# EAGLE design Nido (EAGLE 9.5.2)
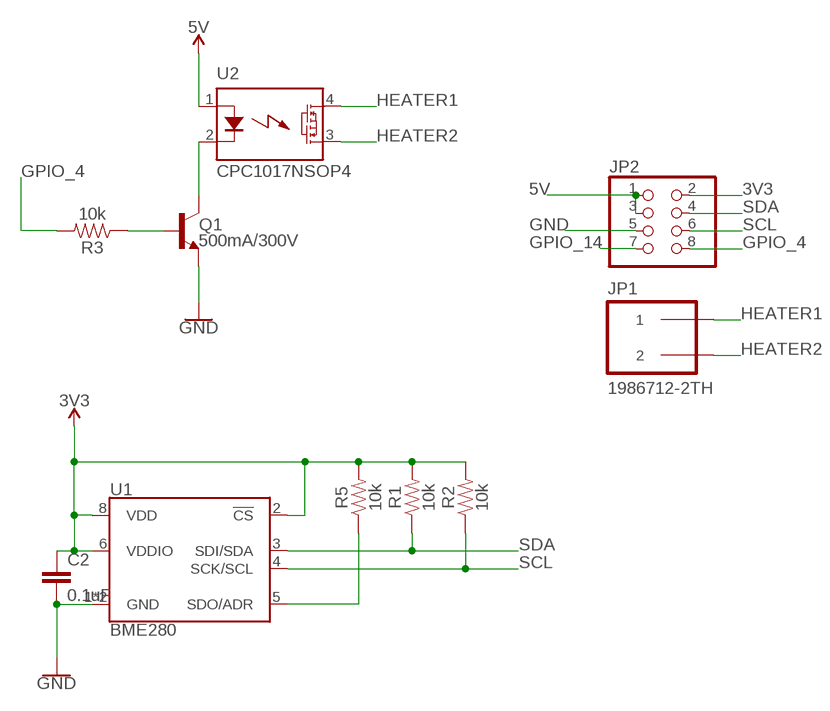
[diagram p0: schematic, sheet 1]

## Parts
C2  0.1uF  0.1UF-0402-16V-10%  [0402]
JP1  1986712-2TH  [1986712-2]
JP2  PINHD-2X4  [2X04]
Q1  500mA/300V  TRANS_NPN-MMBTA42  [SOT23-3]
R1  10k  10KOHM-0402-1/16W-1%  [0402]
R2  10k  10KOHM-0402-1/16W-1%  [0402]
R3  10k  10KOHM-0402-1/16W-1%  [0402]
R5  10k  10KOHM-0402-1/16W-1%  [0402]
U1  BME280  [LGA-8-2.5X2.5]
U2  CPC1017NSOP4  [CPC1017N]

## Nets
3V3: C2.1 JP2.2 R1.2 R2.2 R5.2 U1.2(!CS) U1.6(VDDIO) U1.8(VDD)
5V: JP2.1 JP2.3 U2.1(+CONTROL)
GND: C2.2 JP2.5 Q1.2(E) U1.1(GND) U1.7(GND)
GPIO_4: JP2.8 R3.2
GPIO_14: JP2.7
HEATER1: JP1.P$1 JP1.P$2 U2.4(LOAD2)
HEATER2: JP1.P$3 JP1.P$4 U2.3(LOAD1)
N$1: R5.1 U1.5(SDO/ADR)
N$5: Q1.3(C) U2.2(-CONTROL)
N$6: Q1.1(B) R3.1
SCL: JP2.6 R2.1 U1.4(SCK/SCL)
SDA: JP2.4 R1.1 U1.3(SDI/SDA)

## Library data of the parts
C2 = SparkFun-Capacitors:0.1UF: 0.1µF ceramic capacitors A capacitor is a passive two-terminal electrical component used to store electrical energy temporarily in an electric field.; PROD_ID: CAP-12416
JP1 = nido:1986712-2: TE Connectivity 1986712-2 is a 2-pin wire-to-board spring type connector. It supports wire gauges between 12 and 30 AWG. More information can be found here: https://www.digikey.com/product-detail/en/te-connectivity-amp-connectors/1986712-2/A104578-ND/3189881
JP2 = pinhead:PINHD-2X4: PIN HEADER
Q1 = SparkFun-DiscreteSemi:TRANS_NPN: NPN transistor Current controlled devices typically used to amplify current or used as a switch. BC547 - COM-08928 <http://www.sparkfun.com/products/8928> (TO-92 45V 100mA) (1.Collector 2.Base 3.Emitter) 2N3904 - COM-00521 <http://www.sparkfun.com/products/521> (TO-92 40V 200mA) (1.Emitter 2.Base 3.Collector) P2N2222A - COM-12852 <http://www.sparkfun.com/products/12852> (TO-92 40V 600mA) (1.Collector 2.Base 3.Emitter); PROD_ID: TRANS-09116
R1-R3 R5 = SparkFun-Resistors:10KOHM: 10kΩ resistor A resistor is a passive two-terminal electrical component that implements electrical resistance as a circuit element. Resistors act to reduce current flow, and, at the same time, act to lower voltage levels within circuits. - Wikipedia; PROD_ID: RES-14241
U1 = SparkFun-Sensors:BME280: Bosch BME280 – Combined Humidity and Pressure Sensor The BME280 is as combined digital humidity, pressure and temperature sensor based on proven sensing principles. The sensor module is housed in an extremely compact metal-lid LGA package with a footprint of only 2.5×2.5mm² with a height of 0.93mm. Its small dimensions and its low power consumption allow the implementation in battery driven devices such as handsets, GPS modules or watches. Datasheet <https://cdn.sparkfun.com/assets/learn_tutorials/4/1/9/BST-BME280_DS001-10.pdf> SparkFun Products SparkFun Atmospheric Sensor Breakout - BME280 <https://www.sparkfun.com/products/13676> (SEN-13676); PROD_ID: IC-13090
U2 = nido:CPC1017N

## Board
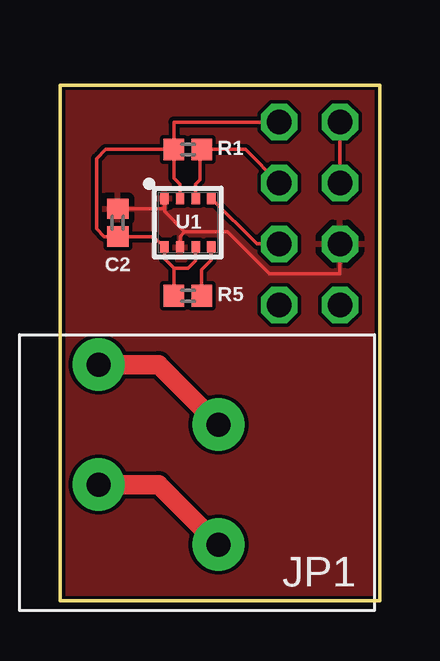
[diagram p1: board, top side]
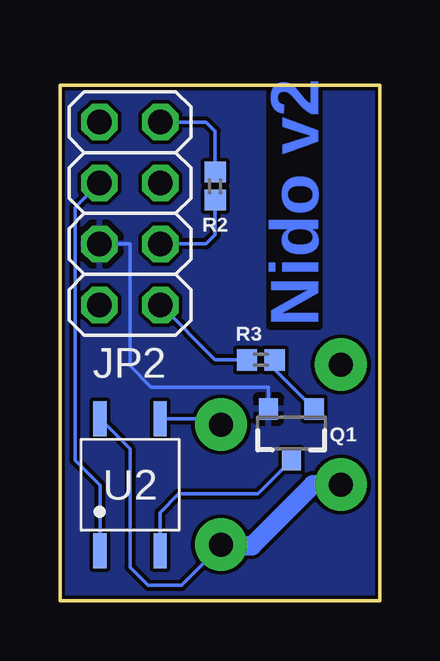
[diagram p2: board, bottom side, seen from below]

Size 13.33 x 21.46 mm. Coordinates in mm from the lower left corner, seen from the top.
Outline: 0,0 13.33,0 13.33,21.46 0,21.46 0,0
Copper layers (1*16): Top 0.035559375mm / dielectric 1.6mm / Bottom 0.035559375mm
Design rules "oshpark-2layer *": minimum track width 6mil, minimum drill 10mil, track to track 6mil, track to pad 6mil, pad to pad 6mil, via to via 6mil, smd to smd 6mil, copper to edge 5mil, drill to drill 6mil, minimum pad ring 5mil, minimum via ring 5mil, stop-mask expansion 2.5mil, vias tented up to drill 0mil, thermal gap 10mil

### Footprints (pad centres in the part's own frame; a part is rotated, then mirrored left to right if it is on the bottom)
0402 = smd 0.85 x 0.9: 1 -0.58,0; 2 0.58,0
1986712-2 = drill 1 pad 2.184: P$1 -3,-0.9; P$2 -0.5,4.1; P$3 2,-0.9; P$4 4.5,4.1
2X04 = drill 1.016 octagon: 1 -3.81,-1.27; 2 -3.81,1.27; 3 -1.27,-1.27; 4 -1.27,1.27; 5 1.27,-1.27; 6 1.27,1.27; 7 3.81,-1.27; 8 3.81,1.27
SOT23-3 = smd 0.8 x 0.9: 1 -0.95,-1; 2 0.95,-1; 3 0,1.1
LGA-8-2.5X2.5 = smd 0.35 x 0.5: 1 -0.975,1.025; 2 -0.325,1.025; 3 0.325,1.025; 4 0.975,1.025; 5 0.975,-1.025; 6 0.325,-1.025; 7 -0.325,-1.025; 8 -0.975,-1.025
CPC1017N = smd 0.55 x 1.45: 1 -1.252,-2.75; 2 1.252,-2.75; 3 1.252,2.75; 4 -1.252,2.75

### Placement (x,y rotation side)
C2  2.41,15.75 90 top
JP1  5.71,5.33 90 top
JP2  10.41,16.13 270 bottom
Q1  3.68,6.99 180 bottom
R1  5.33,18.8 180 top
R2  6.86,17.27 90 bottom
R3  4.95,10.03 180 bottom
R5  5.33,12.7 180 top
U1  5.33,15.75 0 top
U2  10.41,4.83 0 bottom

### Tracks (layer width: path | path; a pad name or v marks a point on that pad's centre or on a via)
3V3
  Top 0.152: R5.2 4.75,13.84 | U1.6 5.66,14.17 5.33,13.84 4.75,13.84 | R1.2 4.75,19.94 JP2.2 | 4.75,13.84 4.36,14.24 U1.8 3.91,15.17 C2.1 1.85,15.17 1.52,15.49 1.52,18.41 1.91,18.8 R1.2 | U1.2 5.01,17.34 4.75,17.6 R1.2
  Bottom 0.152: R2.2 6.86,19.56 7.24,19.94 JP2.2
5V
  Top 0.152: JP2.1 JP2.3
  Bottom 0.152: U2.1 11.67,4.81 12.7,5.84 12.7,16.38 JP2.3
GND
  Top 0.152: U1.7 5.01,15.17 5.21,15.37 | U1.1 4.36,16.38 | 4.36,16.38 4.36,16.21 5.21,15.37 | 5.21,15.37 6.98,15.37 8.73,13.61 11.68,13.61 JP2.5 | C2.2 4.3,16.33 4.36,16.38
  Bottom 0.152: Q1.2 4.63,8.89 9.53,8.89 10.41,9.78 10.41,14.86 JP2.5
  pour Top: 13.33,21.46 -1.91,21.46 -1.91,-0.64 13.33,-0.64
  pour Bottom: 13.33,21.46 -1.91,21.46 -1.91,-0.64 13.33,-0.64
GPIO_4
  Bottom 0.152: R3.2 6.86,10.03 JP2.8
HEATER1
  Top 0.813: JP1.P$2 4.12,4.83 JP1.P$1
  Bottom 0.152: U2.4 10.41,6.32 10.41,1.4 9.65,0.64 8.26,0.64 6.62,2.28 6.62,2.29 JP1.P$1
  Bottom 0.813: JP1.P$2 2.79,4.83 5.33,2.29 6.62,2.29
HEATER2
  Top 0.813: JP1.P$4 4.12,9.83 JP1.P$3
  Bottom 0.152: U2.3 6.86,7.58 JP1.P$3
N$1
  Top 0.152: R5.1 5.91,13.79 6.31,14.18 U1.5
N$5
  Bottom 0.152: U2.2 9.16,3.67 8.38,4.45 5.08,4.45 3.68,5.84 Q1.3
N$6
  Bottom 0.152: Q1.1 4.37,9.62 R3.1
SCL
  Top 0.152: U1.4 8.22,14.86 JP2.6
  Bottom 0.152: JP2.6 7.24,14.86 6.86,15.24 R2.1
SDA
  Top 0.152: U1.3 5.66,17.34 5.84,17.53 5.84,18.72 R1.1 7.75,18.8 JP2.4

### Text on the board
Bottom: Nido v2
bStop: Nido v2